# Altium schematic sheet XDS100_V2.SchDoc
size A4; SheetNumber: 9; SheetTotal: 9
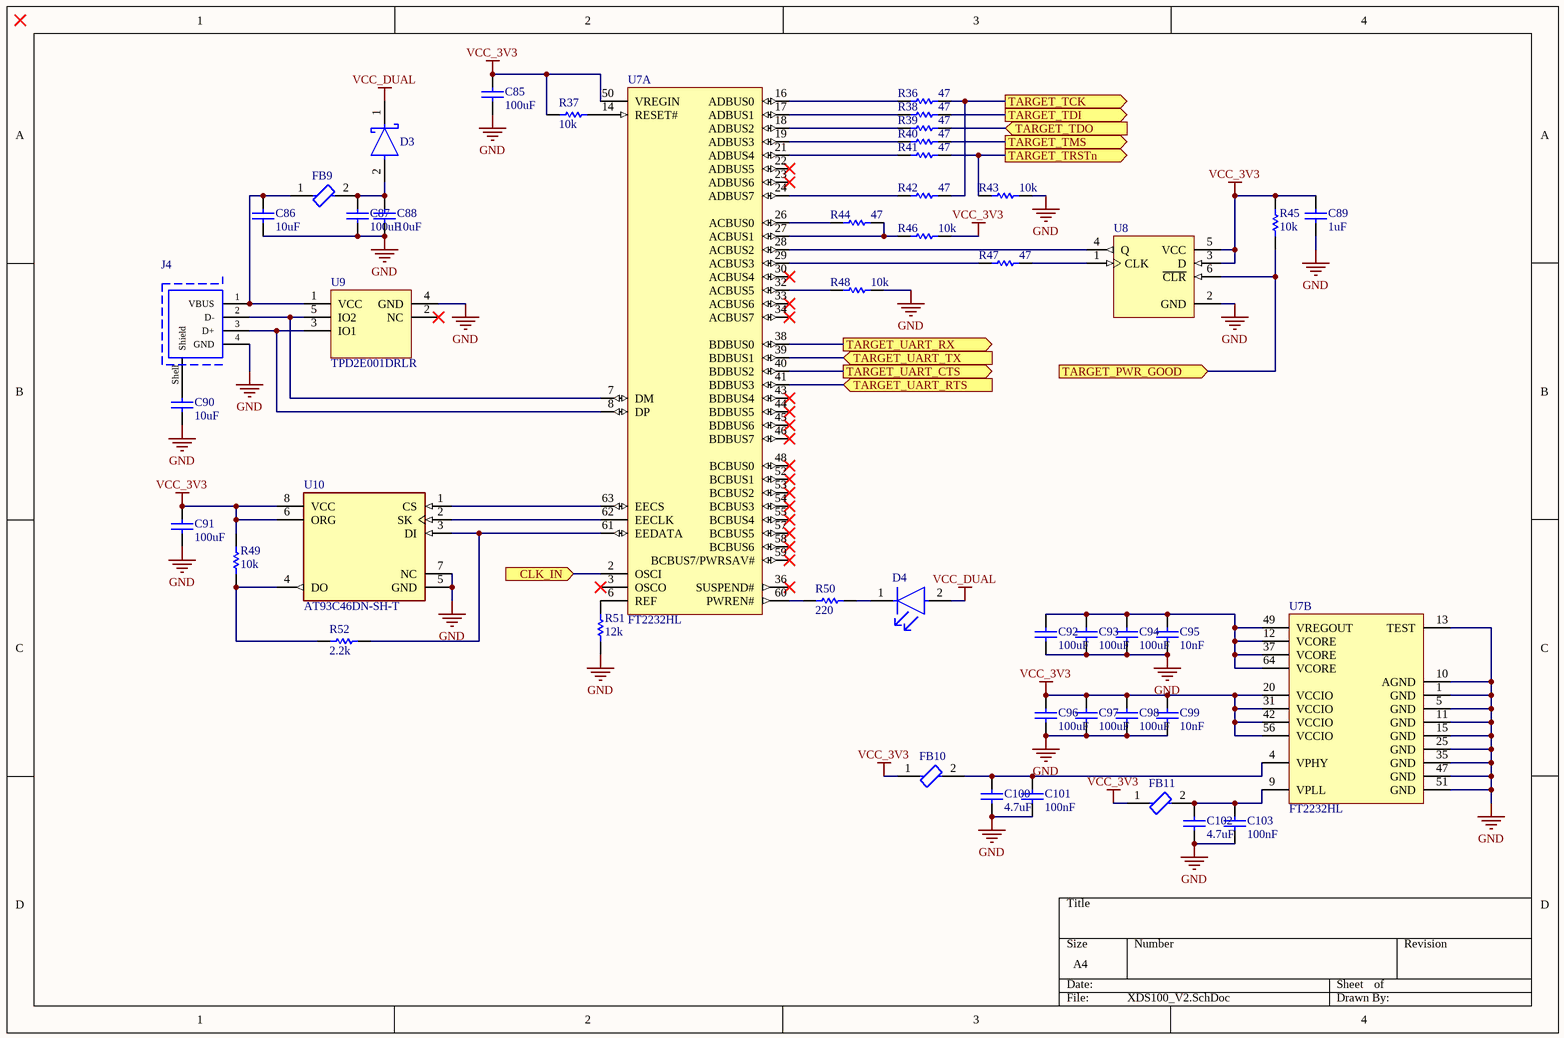
[diagram p0: XDS100_V2.SchDoc]

## Parts
C85  100uF  [0805_C_S]
C86  10uF  [0805_C_S]
C87  100uF  [0805_C_S]
C88  10uF  [0805_C_S]
C89  1uF  [0805_C_S]
C90  10uF  [0805_C_S]
C91  100uF  [0805_C_S]
C92  100uF  [0805_C_S]
C93  100uF  [0805_C_S]
C94  100uF  [0805_C_S]
C95  10nF  [0805_C_S]
C96  100uF  [0805_C_S]
C97  100uF  [0805_C_S]
C98  100uF  [0805_C_S]
C99  10nF  [0805_C_S]
C100  4.7uF  [0805_C_S]
C101  100nF  [0805_C_S]
C102  4.7uF  [0805_C_S]
C103  100nF  [0805_C_S]
D3  MBR0520LT1G  [FP-425-04-IPC_C]  (value not drawn)
D4  LTST-C150AKT  [FP-LTST-C150AKT-MFG]  (value not drawn)
FB9  BLM21PG221SN1D  [FP-BLM21-0_2-t0_85-e0_5-IPC_B]  (value not drawn)
FB10  BLM21PG221SN1D  [FP-BLM21-0_2-t0_85-e0_5-IPC_B]  (value not drawn)
FB11  BLM21PG221SN1D  [FP-BLM21-0_2-t0_85-e0_5-IPC_B]  (value not drawn)
J4  62900416021  [62900416021]  (value not drawn)
R36  47  [0805_R_S]
R37  10k  [0805_R_S]
R38  47  [0805_R_S]
R39  47  [0805_R_S]
R40  47  [0805_R_S]
R41  47  [0805_R_S]
R42  47  [0805_R_S]
R43  10k  [0805_R_S]
R44  47  [0805_R_S]
R45  10k  [0805_R_S]
R46  10k  [0805_R_S]
R47  47  [0805_R_S]
R48  10k  [0805_R_S]
R49  10k  [0805_R_S]
R50  220  [0805_R_S]
R51  12k  [0805_R_S]
R52  2.2k  [0805_R_S]
U7  FT2232HL  [FTDI-LQFP-64_L]  (parts A,B of 2)
U8  SN74LVC1G175DBVR  [DBV0006A_L]  (value not drawn)
U9  TPD2E001DRLR  [DRL0005A_L]
U10  AT93C46DN-SH-T  [FP-C04-057-SN-MFG]

## Ports
CLK_IN (in), TARGET_PWR_GOOD (in), TARGET_TCK (out), TARGET_TDI (out), TARGET_TDO (in), TARGET_TMS (out), TARGET_TRSTn (out), TARGET_UART_CTS (out), TARGET_UART_RTS (in), TARGET_UART_RX (out), TARGET_UART_TX (in)

## Nets
GND: C85.1 C86.1 C87.1 C88.1 C89.1 C90.1 C91.1 C92.1 C93.1 C94.1 C95.1 C96.1 C97.1 C98.1 C99.1 C100.1 C101.1 C102.1 C103.1 J4.4(GND) R43.2 R48.2 R51.2 U7.1(GND) U7.5(GND) U7.10(AGND) U7.11(GND) U7.13(TEST) U7.15(GND) U7.25(GND) U7.35(GND) U7.47(GND) U7.51(GND) U8.2(GND) U9.4(GND) U10.5(GND) U10.7(NC)
VCC_3V3: C85.2 C89.2 C91.2 C96.2 C97.2 C98.2 C99.2 FB10.1 FB11.1 R37.1 R45.1 R46.2 R49.1 U7.20(VCCIO) U7.31(VCCIO) U7.42(VCCIO) U7.50(VREGIN) U7.56(VCCIO) U8.3(D) U8.5(VCC) U10.6(ORG) U10.8(VCC)
VCC_DUAL: D3.1(C) D4.2(A)
CLK_IN: U7.2(OSCI) ; port CLK_IN
TARGET_PWR_GOOD: R45.2 U8.6(~{CLR}) ; port TARGET_PWR_GOOD
TARGET_TCK: R36.2 R42.2 ; port TARGET_TCK
TARGET_TDI: R38.2 ; port TARGET_TDI
TARGET_TDO: R39.2 ; port TARGET_TDO
TARGET_TMS: R40.2 ; port TARGET_TMS
TARGET_TRSTn: R41.2 R43.1 ; port TARGET_TRSTn
TARGET_UART_CTS: U7.40(BDBUS2) ; port TARGET_UART_CTS
TARGET_UART_RTS: U7.41(BDBUS3) ; port TARGET_UART_RTS
TARGET_UART_RX: U7.38(BDBUS0) ; port TARGET_UART_RX
TARGET_UART_TX: U7.39(BDBUS1) ; port TARGET_UART_TX
NetC86_2: C86.2 FB9.1 J4.1(VBUS) U9.1(VCC)
NetC87_2: C87.2 C88.2 D3.2(A) FB9.2
NetC90_2: C90.2 J4.Shell(Shield)
NetC92_2: C92.2 C93.2 C94.2 C95.2 U7.12(VCORE) U7.37(VCORE) U7.49(VREGOUT) U7.64(VCORE)
NetC100_2: C100.2 C101.2 FB10.2 U7.4(VPHY)
NetC102_2: C102.2 C103.2 FB11.2 U7.9(VPLL)
NetD4_1: D4.1(C) R50.2
NetJ4_2: J4.2(D-) U7.7(DM) U9.5(IO2)
NetJ4_3: J4.3(D+) U7.8(DP) U9.3(IO1)
NetR36_1: R36.1 U7.16(ADBUS0)
NetR37_2: R37.2 U7.14(RESET#)
NetR38_1: R38.1 U7.17(ADBUS1)
NetR39_1: R39.1 U7.18(ADBUS2)
NetR40_1: R40.1 U7.19(ADBUS3)
NetR41_1: R41.1 U7.21(ADBUS4)
NetR42_1: R42.1 U7.24(ADBUS7)
NetR44_1: R44.1 U7.26(ACBUS0)
NetR44_2: R44.2 R46.1 U7.27(ACBUS1)
NetR47_1: R47.1 U7.29(ACBUS3)
NetR47_2: R47.2 U8.1(CLK)
NetR48_1: R48.1 U7.32(ACBUS5)
NetR49_2: R49.2 R52.1 U10.4(DO)
NetR50_1: R50.1 U7.60(PWREN#)
NetR51_1: R51.1 U7.6(REF)
NetR52_2: R52.2 U7.61(EEDATA) U10.3(DI)
NetU7_28: U7.28(ACBUS2) U8.4(Q)
NetU7_62: U7.62(EECLK) U10.2(SK)
NetU7_63: U7.63(EECS) U10.1(CS)

Not connected (* = marked no-connect by the designer): U7 3(OSCO)* 22(ADBUS5)* 23(ADBUS6)* 30(ACBUS4)* 33(ACBUS6)* 34(ACBUS7)* 36(SUSPEND#)* 43(BDBUS4)* 44(BDBUS5)* 45(BDBUS6)* 46(BDBUS7)* 48(BCBUS0)* 52(BCBUS1)* 53(BCBUS2)* 54(BCBUS3)* 55(BCBUS4)* 57(BCBUS5)* 58(BCBUS6)* 59(BCBUS7/PWRSAV#)*; U9 2(NC)*

## Library data of the parts
C85-C103 = Cap: Capacitor; Published: 8-Jun-2000; LatestRevisionDate: 17-Jul-2002; LatestRevisionNote: Re-released for DXP Platform.; Publisher: Altium Limited
  C85 C87 C91-C94 C96-C98: Value: 100uF
  C86 C88 C90: Value: 10uF
  C89: Value: 1uF
  C95 C99: Value: 10nF
  C100 C102: Value: 4.7uF
  C101 C103: Value: 100nF
D3 = CMP-1055-00425-2: DIODE SCHOTTKY 20V 500MA SOD123; Polarity: Standard; Peak Non-Repetitive Surge Current: 5.5A; Forward Voltage: 385mV; Element Configuration: Single; Peak Reverse Current: 250uA; Max Repetitive Reverse Voltage (Vrrm): 20V; Voltage Rating (DC): 20V; Case/Package: SOD-123-2; Number of Pins: 2; Output Current: 500mA; Min Operating Temperature: -65°C; Lead Free: Lead Free; REACH SVHC: No SVHC; Max Reverse Voltage (DC): 20V; Termination: SMD/SMT; Average Rectified Current: 500mA; Max Surge Current: 5.5A; Package Quantity: 3000; Height: 1.12mm; Current Rating: 500mA; Forward Current: 500mA; Max Forward Surge Current (Ifsm): 5.5A; Packaging: Tape and Reel; Length: 2.69mm; Radiation Hardening: No; Max Reverse Leakage Current: 250uA; Width: 1.6mm; Contact Plating: Tin; Max Operating Temperature: 125°C
D4 = CMP-22017-000004-1: LED AMBER CLEAR SMD; Manufacturer: Lite-On; Luminous Intensity: 6mcd; Viewing Angle: 130°; Wavelength: 602nm; Reverse Voltage: 5V; Forward Current: 30mA; Led Orientation: Top View; Power Dissipation: 100mW; Peak Emmision Wavelength: 610nm; Forward Voltage: 2.1V; ComponentLink2Description: Datasheet; Device Class L3: unset; Height: 1.2mm; RoHS: TRUE; ComponentLink2URL: https://media.digikey.com/pdf/Data%20Sheets/Lite-On%20PDFs/LTST-C150AKT.pdf; Temperature: -55°C to +85°C; Package: 0; Automotive: No; Manufacturer Part Number: LTST-C150AKT; Temperature Range Low: -55°C; Device Class L2: LEDs; Device Class L1: Optoelectronics; Octopart: https://octopart.com/ltst-c150akt-lite-on-549804; Digikey Description: LED AMBER CLEAR SMD; Colour: Amber; Category: Diode; Mouser Description: Standard LEDs - SMD Amber Clear 602nm; Lead Free: Yes; Temperature Range High: +85°C
FB9-FB11 = CMP-0686-00610-3: Chip Ferrite Bead, 0805, 220Ω @ 100MHz, 0.045Ω, 25%, 2A; Number of Circuits: 1; Shielding: Unshielded; DC Resistance (DCR): 45mR; Impedance: 220R; Radiation Hardening: No; Material: Ferrite; Frequency: 100MHz; Width: 1.25mm; DC Current: 2A; Max DC Current: 2A; Number of Lines: 1; Package Quantity: 1; Case Code (Metric): 2012; Current Rating: 2A; Case/Package: 0805; Current: 2A; Military Standard: Not; Core Material: Ferrite; Depth: 1.25mm; Contact Plating: Tin; DC Resistance-Max: 45mR; Max Operating Temperature: 125°C; Length: 2mm; Max Current Rating: 2A; REACH SVHC: No SVHC; Termination: SMD/SMT; Min Operating Temperature: -55°C; Series: BLM21P; Test Frequency: 100MHz; Tolerance: 25%; Number of Pins: 2; RoHS Compliant: Yes; Height: 0.85mm; Packaging: Tape and Reel; Lead Free: Lead Free; Case Code (Imperial): 0805
J4 = CMP-1502-03240-1: USB 2.0 Type A Receptacle WR-COM, Horizontal, SMT; Manufacturer: Wurth Elektronik; Rated Current: 1.5A; Contact Resistance: 20mOhm; Working Voltage: 30VAC; Operating Temperature: -40to105degC; Packaging: Tray; Package Reference: 62900416021; Gender: Receptacle; Datasheet URL: https://katalog.we-online.de/em/datasheet/62900416021.pdf; Manufacturer URL: http://www.we-online.de; Part Number: 62900416021; Mounting Technology: SMT; Connector Type: USB2.0TypeA; Orientation: Horizontal; Publisher: WurthElektronik
R36-R52 = Res1: Resistor; Published: 8-Jun-2000; LatestRevisionDate: 17-Jul-2002; LatestRevisionNote: Re-released for DXP Platform.; Publisher: Altium Limited
  R36 R38-R42 R44 R47: Value: 47
  R37 R43 R45 R46 R48 R49: Value: 10k
  R50: Value: 220
  R51: Value: 12k
  R52: Value: 2.2k
U7 = CMP-2000-06287-1: Dual High Speed USB to Multipurpose UART / FIFO IC / , 3 to 3.6 V, -40 to 85 degC, 64- Pin LQFP, RoHS; Manufacturer: FTDI; Number of Channels per Chip: 2; Standard Supported: RS232,RS422,RS485; Maximum Data Rate: 480Mbit/s; Package Description: 64-Pin Low-profile Quad Flat Package, Body 10 x 10 mm, Pitch 0.5 mm; Maximum Operating Temperature: +85°C; Mounting Technology: SurfaceMount; Pin Count: 64; Package Reference: LQFP-64; Manufacturer URL: http://www.nxp.com/; Length: 10mm; Width: 10mm; Minimum Operating Temperature: -40°C; Dimensions: 10x10x1.4mm; Package Type: LQFP; Mounting Type: SurfaceMount; Datasheet URL: http://www.ftdichip.com/Support/Documents/DataSheets/ICs/DS_FT2232H.pdf; Datasheet Version: Rev. 2.5, 07/2016; Height: 1.4mm
U8 = CMP-0859-00200-3: Single D-Type Flip-Flop with Asynchronous Clear, DBV0006A, LARGE T&R; Manufacturer: Texas Instruments; VCC(Min)(V): 1.65; Output Type: CMOS; Rating: Catalog; Bits(#): 1; Schmitt Trigger: No; ICC @ Nom Voltage(Max)(mA): 0.01; Input Type: CMOS/TTL; tpd @ Nom Voltage(Max)(ns): 13.4,7.1,5.7,4; Technology Family: LVC; Logic: True; Voltage(Nom)(V): 1.8,2.5,3.3,5; Output Drive (IOL/IOH)(Max)(mA): 32/-32; F @ Nom Voltage(Max)(Mhz): 150; VCC(Max)(V): 5.5; Operating Temperature Range(C): -40 to 125,-40 to 85; 3-State Output: No; Sub-Family: D-Type Flip-Flop; PackageReference: DBV0006A; Generic Part Number: SN74LVC1G175; DatasheetVersion: SCES560F
U9 = CMP-0326-00048-3: Low-Capacitance + / - 15 kV ESD-Protection Array for High-Speed Data Interfaces, 2 Channels, -40 to +85 degC, 5-pin SOT (DRL), Green (RoHS & no Sb/Br); Manufacturer: Texas Instruments; IO Leakage Current(nA): 1; IEC 61000-4-2 Air-Gap(+/- kV): 15; IEC 61000-4-2 Contact(+/- kV): 8; SubFamily: ESD Solution; IO Capacitance(Typ)(pF): 1.5; Breakdown Voltage(Min)(V): 11; USB High Speed: TRUE; ComponentLink3Description: URL Link1; PackageReference: DRL0005A; PartNumber: TPD2E001DRLR; PackageDescription: 5-Pin Plastic Small Outline, Flat Lead 0.5 mm Pitch; PackageVersion: revD, Aug-2007; DatasheetVersion: SLLS684F; ComponentLink1Description: Manufacturer URL; ComponentLink2Description: Datasheet; ComponentLink1URL: http://www.ti.com/; ComponentLink2URL: http://www.ti.com/general/docs/lit/getliterature.tsp?genericPartNumber=TPD2E001&fileType=pdf; ComponentLink3URL: SamplesURL:http://www.ti.com/product/tpd2e001#samples; Eco-Plan: Green (RoHS & no Sb/Br); Mounting Technology: Surface Mount
U10 = CMP-06313-000016-1: IC EEPROM 1K SPI 2MHZ 8SOIC; Manufacturer: Microchip; Nominal Supply Current: 0.5mA; Memory Size: 1Kbits; Access Time: 1000ns; Max Supply Voltage: 5.5V; Interface: Other; Standoff Height: 0.1mm; Min Supply Voltage: 1.8V; Category: IC; Temperature Range High: +85°C; Mouser Description: EEPROM Serial-3Wire 1K-Bit 128 x 8/64 x 16 2.5V/3.3V/5V 8-Pin SOIC T/R; Ipc Land Pattern Name: SOIC127P600X175-8; Temperature Range Low: -40°C; Temperature: -40°C to +85°C; Digikey Description: IC EEPROM 1K SPI 2MHZ 8SOIC; Lead Free: Yes; Device Class L2: Memory; ComponentLink2URL: http://ww1.microchip.com/downloads/en/DeviceDoc/20006224B.pdf; Automotive: No; Device Class L3: EEPROM; Package: C04-057-SN; Octopart: https://octopart.com/at93c46dn-sh-t-microchip-77759177; RoHS: TRUE; Memory Type: EEPROM; Height: 1.75mm; Manufacturer Part Number: AT93C46DN-SH-T; ComponentLink2Description: Datasheet; Frequency: 2MHz; Device Class L1: Integrated Circuits (ICs)